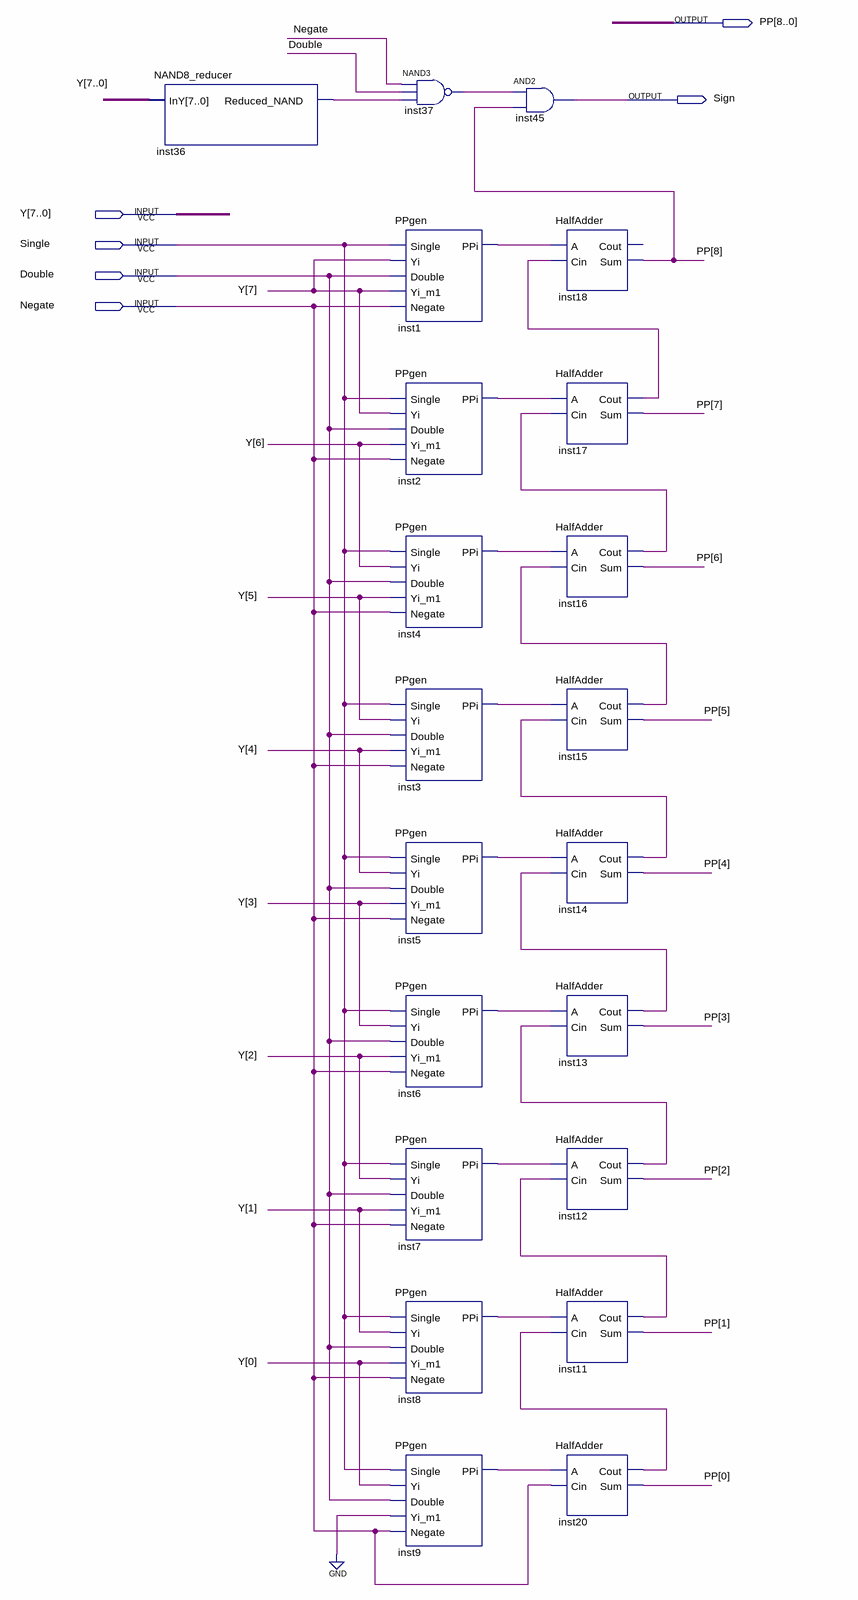
[diagram p0: schematic sheet]
// Quartus schematic PPgen_9bits.bdf as structural Verilog: 21 symbols, 6 pins
module PPgen_9bits (
  input  [7:0] Y,
  input  Single,
  input  Double,
  input  Negate,
  output [8:0] PP,
  output Sign
);

  wire inst1_ppi, inst2_ppi, inst3_ppi, inst4_ppi, inst5_ppi, inst6_ppi, inst7_ppi, inst8_ppi, inst9_ppi,
       inst11_cout, inst12_cout, inst13_cout, inst14_cout, inst15_cout, inst16_cout, inst17_cout,
       inst20_cout, inst36_reduced_nand, inst37_out;

  NAND8_reducer inst36 (.InY(Y), .Reduced_NAND(inst36_reduced_nand));
  PPgen inst1 (.Single(Single), .Yi(Y[7]), .Double(Double), .Yi_m1(Y[7]), .Negate(Negate), .PPi(inst1_ppi));
  PPgen inst2 (.Single(Single), .Yi(Y[7]), .Double(Double), .Yi_m1(Y[6]), .Negate(Negate), .PPi(inst2_ppi));
  PPgen inst4 (.Single(Single), .Yi(Y[6]), .Double(Double), .Yi_m1(Y[5]), .Negate(Negate), .PPi(inst4_ppi));
  PPgen inst3 (.Single(Single), .Yi(Y[5]), .Double(Double), .Yi_m1(Y[4]), .Negate(Negate), .PPi(inst3_ppi));
  PPgen inst5 (.Single(Single), .Yi(Y[4]), .Double(Double), .Yi_m1(Y[3]), .Negate(Negate), .PPi(inst5_ppi));
  PPgen inst6 (.Single(Single), .Yi(Y[3]), .Double(Double), .Yi_m1(Y[2]), .Negate(Negate), .PPi(inst6_ppi));
  PPgen inst7 (.Single(Single), .Yi(Y[2]), .Double(Double), .Yi_m1(Y[1]), .Negate(Negate), .PPi(inst7_ppi));
  PPgen inst8 (.Single(Single), .Yi(Y[1]), .Double(Double), .Yi_m1(Y[0]), .Negate(Negate), .PPi(inst8_ppi));
  PPgen inst9 (.Single(Single), .Yi(Y[0]), .Double(Double), .Yi_m1(1'b0), .Negate(Negate), .PPi(inst9_ppi));
  nand inst37 (inst37_out, Negate, Double, inst36_reduced_nand);
  and inst45 (Sign, inst37_out, PP[8]);
  HalfAdder inst18 (.A(inst1_ppi), .Cin(inst17_cout), .Sum(PP[8]));  // open: Cout
  HalfAdder inst17 (.A(inst2_ppi), .Cin(inst16_cout), .Cout(inst17_cout), .Sum(PP[7]));
  HalfAdder inst16 (.A(inst4_ppi), .Cin(inst15_cout), .Cout(inst16_cout), .Sum(PP[6]));
  HalfAdder inst15 (.A(inst3_ppi), .Cin(inst14_cout), .Cout(inst15_cout), .Sum(PP[5]));
  HalfAdder inst14 (.A(inst5_ppi), .Cin(inst13_cout), .Cout(inst14_cout), .Sum(PP[4]));
  HalfAdder inst13 (.A(inst6_ppi), .Cin(inst12_cout), .Cout(inst13_cout), .Sum(PP[3]));
  HalfAdder inst12 (.A(inst7_ppi), .Cin(inst11_cout), .Cout(inst12_cout), .Sum(PP[2]));
  HalfAdder inst11 (.A(inst8_ppi), .Cin(inst20_cout), .Cout(inst11_cout), .Sum(PP[1]));
  HalfAdder inst20 (.A(inst9_ppi), .Cin(Negate), .Cout(inst20_cout), .Sum(PP[0]));
endmodule
